# Altium schematic sheet ee453_pcb_ret.SchDoc
size A
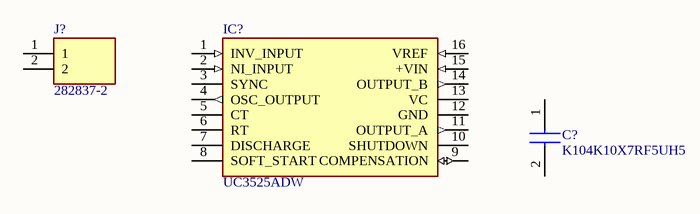
[diagram p0: ee453_pcb_ret.SchDoc]

## Parts
C?  K104K10X7RF5UH5  [K104K10X7RF5UH5]
IC?  UC3525ADW  [SOIC127P1030X265-16N]
J?  282837-2  [2828372]

## Nets

Not connected (* = marked no-connect by the designer): C? 1 2; IC? 1(INV_INPUT) 2(NI_INPUT) 3(SYNC) 4(OSC_OUTPUT) 5(CT) 6(RT) 7(DISCHARGE) 8(SOFT_START) 9(COMPENSATION) 10(SHUTDOWN) 11(OUTPUT_A) 12(GND) 13(VC) 14(OUTPUT_B) 15(+VIN) 16(VREF); J? 1 2

## Library data of the parts
C? = K104K10X7RF5UH5: Capacitor; Manufacturer_Name: Vishay; Datasheet Link: https://www.vishay.com/docs/45171/kseries.pdf; Height: 6.2mm; Manufacturer_Part_Number: K104K10X7RF5UH5; Mouser Part Number: 594-K104K10X7RF5UH5; Mouser Price/Stock: https://www.mouser.co.uk/ProductDetail/Vishay-BC-Components/K104K10X7RF5UH5?qs=rLgk8CAOBHbAqIwDswVbzA%3D%3D; Arrow Part Number: K104K10X7RF5UH5; Arrow Price/Stock: https://www.arrow.com/en/products/k104k10x7rf5uh5/vishay?region=nac
IC? = UC3525ADW: Integrated Circuit; Manufacturer_Name: Texas Instruments; Datasheet Link: http://www.ti.com/lit/ds/symlink/uc3525a.pdf; Height: 2.65mm; Manufacturer_Part_Number: UC3525ADW; Mouser Part Number: 595-UC3525ADW; Mouser Price/Stock: https://www.mouser.co.uk/ProductDetail/Texas-Instruments/UC3525ADW?qs=L5CvrNUdZiq0Vdyb38QMqA%3D%3D; Arrow Part Number: UC3525ADW; Arrow Price/Stock: https://www.arrow.com/en/products/uc3525adw/texas-instruments?region=nac
J? = 282837-2: Connector; Manufacturer_Name: TE Connectivity; Datasheet Link: https://www.te.com/commerce/DocumentDelivery/DDEController?Action=srchrtrv&DocNm=282837&DocType=Customer+Drawing&DocLang=English&DocFormat=pdf&PartCntxt=282837-2; Height: 10.3mm; Manufacturer_Part_Number: 282837-2; Mouser Part Number: 571-2828372; Mouser Price/Stock: https://www.mouser.co.uk/ProductDetail/TE-Connectivity/282837-2?qs=A%252Bip%252BNCYi6O2H0NGWOeAxg%3D%3D; Arrow Part Number: 282837-2; Arrow Price/Stock: https://www.arrow.com/en/products/282837-2/te-connectivity?region=nac